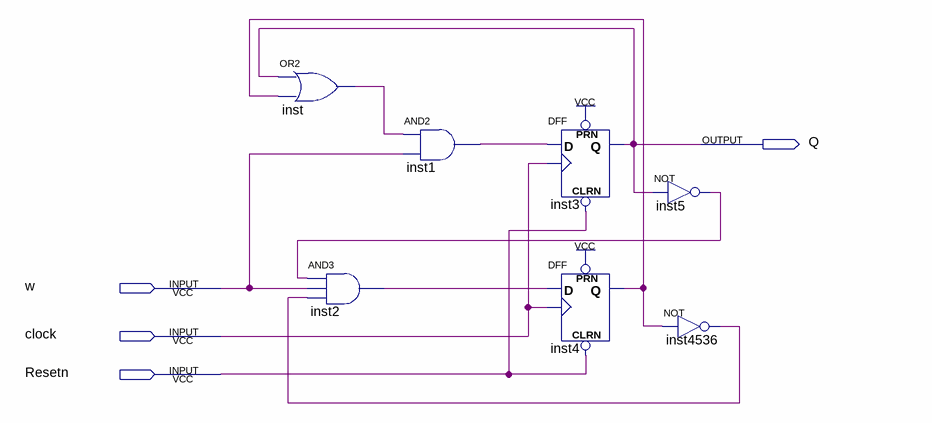
[diagram p0: schematic sheet]
// Quartus schematic Lab8.bdf as structural Verilog: 7 symbols, 4 pins
module Lab8 (
  input  w,
  input  clock,
  input  Resetn,
  output Q
);

  wire inst1_out, inst2_out, inst4_q, inst5_out, inst4536_out, inst_out;

  or inst (inst_out, Q, inst4_q);
  and inst2 (inst2_out, inst5_out, w, inst4536_out);
  and inst1 (inst1_out, inst_out, w);
  DFF inst3 (.CLRN(Resetn), .CLK(clock), .D(inst1_out), .PRN(1'b1), .Q(Q));
  DFF inst4 (.CLRN(Resetn), .CLK(clock), .D(inst2_out), .PRN(1'b1), .Q(inst4_q));
  not inst5 (inst5_out, Q);
  not inst4536 (inst4536_out, inst4_q);
endmodule
